# EAGLE design PowerSpy (EAGLE 9.5.2)
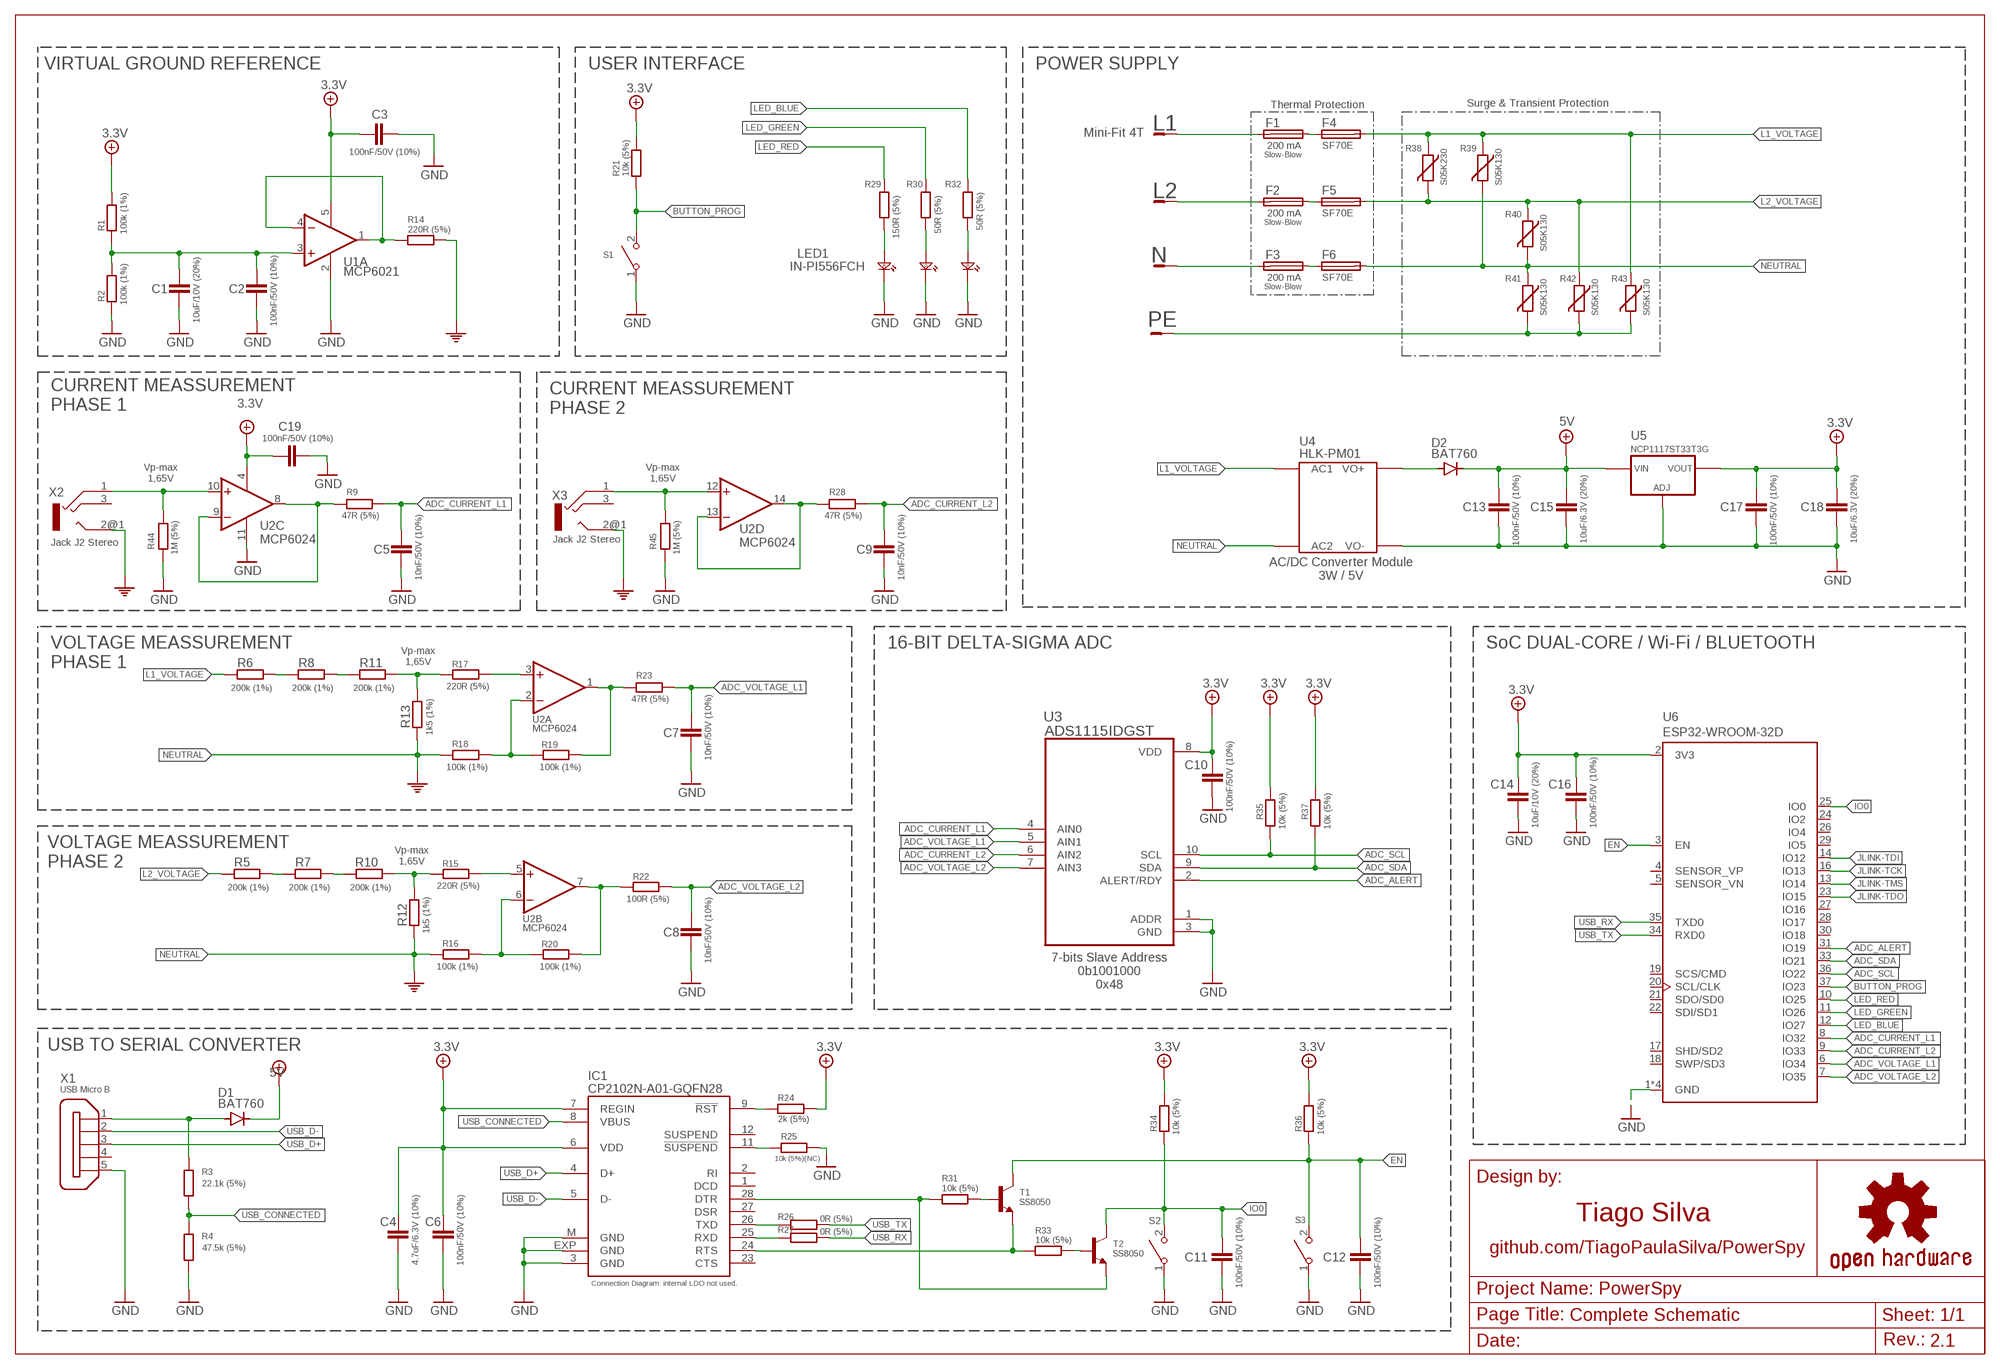
[diagram p0: schematic, sheet 1]

## Parts
C1  10uF/10V (20%)  C-EUC0603K  [C0603K]
C2  100nF/50V (10%)  C-EUC0603K  [C0603K]
C3  100nF/50V (10%)  C-EUC0603K  [C0603K]
C4  4.7uF/6.3V (10%)  C-EUC0603K  [C0603K]
C5  10nF/50V (10%)  C-EUC0603K  [C0603K]
C6  100nF/50V (10%)  C-EUC0603K  [C0603K]
C7  10nF/50V (10%)  C-EUC0603K  [C0603K]
C8  10nF/50V (10%)  C-EUC0603K  [C0603K]
C9  10nF/50V (10%)  C-EUC0603K  [C0603K]
C10  100nF/50V (10%)  C-EUC0603K  [C0603K]
C11  100nF/50V (10%)  C-EUC0603K  [C0603K]
C12  100nF/50V (10%)  C-EUC0603K  [C0603K]
C13  100nF/50V (10%)  C-EUC0603K  [C0603K]
C14  10uF/10V (20%)  C-EUC0603K  [C0603K]
C15  10uF/6.3V (20%)  C-EUC0603K  [C0603K]
C16  100nF/50V (10%)  C-EUC0603K  [C0603K]
C17  100nF/50V (10%)  C-EUC0603K  [C0603K]
C18  10uF/6.3V (20%)  C-EUC0603K  [C0603K]
C19  100nF/50V (10%)  C-EUC0603K  [C0603K]
CN1  Mini-Fit 4T  39-30-04_S  [39-30-?04?]
D1  BAT760  DIODE-SOD323-W  [SOD323-W]
D2  BAT760  DIODE-SOD323-W  [SOD323-W]
F1  200 mA  QPL  [QPL]
F2  200 mA  QPL  [QPL]
F3  200 mA  QPL  [QPL]
F4  SF70E  LITTLEFUSE  [LITTLEFUSE]
F5  SF70E  LITTLEFUSE  [LITTLEFUSE]
F6  SF70E  LITTLEFUSE  [LITTLEFUSE]
IC1  CP2102N-A01-GQFN28  CP2102  [MLP28]
LED1  IN-PI556FCH  [INPI556FCH]
R1  100k (1%)  R-EU_R0603  [R0603]
R2  100k (1%)  R-EU_R0603  [R0603]
R3  22.1k (5%)  R-EU_R0603  [R0603]
R4  47.5k (5%)  R-EU_R0603  [R0603]
R5  200k (1%)  R-EU_R0603  [R0603]
R6  200k (1%)  R-EU_R0603  [R0603]
R7  200k (1%)  R-EU_R0603  [R0603]
R8  200k (1%)  R-EU_R0603  [R0603]
R9  47R (5%)  R-EU_R0603  [R0603]
R10  200k (1%)  R-EU_R0603  [R0603]
R11  200k (1%)  R-EU_R0603  [R0603]
R12  1k5 (1%)  R-EU_R0603  [R0603]
R13  1k5 (1%)  R-EU_R0603  [R0603]
R14  220R (5%)  R-EU_R0603  [R0603]
R15  220R (5%)  R-EU_R0603  [R0603]
R16  100k (1%)  R-EU_R0603  [R0603]
R17  220R (5%)  R-EU_R0603  [R0603]
R18  100k (1%)  R-EU_R0603  [R0603]
R19  100k (1%)  R-EU_R0603  [R0603]
R20  100k (1%)  R-EU_R0603  [R0603]
R21  10k (5%)  R-EU_R0603  [R0603]
R22  100R (5%)  R-EU_R0603  [R0603]
R23  47R (5%)  R-EU_R0603  [R0603]
R24  2k (5%)  R-EU_R0603  [R0603]
R25  10k (5%)(NC)  R-EU_R0603  [R0603]
R26  0R (5%)  R-EU_R0603  [R0603]
R27  0R (5%)  R-EU_R0603  [R0603]
R28  47R (5%)  R-EU_R0603  [R0603]
R29  150R (5%)  R-EU_R0603  [R0603]
R30  50R (5%)  R-EU_R0603  [R0603]
R31  10k (5%)  R-EU_R0603  [R0603]
R32  50R (5%)  R-EU_R0603  [R0603]
R33  10k (5%)  R-EU_R0603  [R0603]
R34  10k (5%)  R-EU_R0603  [R0603]
R35  10k (5%)  R-EU_R0603  [R0603]
R36  10k (5%)  R-EU_R0603  [R0603]
R37  10k (5%)  R-EU_R0603  [R0603]
R38  S05K230  VARISTORS05K11  [S05K11]
R39  S05K130  VARISTORS05K11  [S05K11]
R40  S05K130  VARISTORS05K11  [S05K11]
R41  S05K130  VARISTORS05K11  [S05K11]
R42  S05K130  VARISTORS05K11  [S05K11]
R43  S05K130  VARISTORS05K11  [S05K11]
R44  1M (5%)  R-EU_R0603  [R0603]
R45  1M (5%)  R-EU_R0603  [R0603]
S1  TL3302AF180QG  434121050816  [434121050816]
S2  TL3302AF180QG  434121050816  [434121050816]
S3  TL3302AF180QG  434121050816  [434121050816]
T1  SS8050  BC848  [SOT23]
T2  SS8050  BC848  [SOT23]
U1  MCP6021  [SOT23-5]
U2  MCP6024  [14-SOIC]
U3  ADS1115IDGST  [SOP50P490X110-10N]
U4  HLK-PM01  [HLK-PM01]
U5  NCP1117ST33T3G  REG1117  [SOT223]
U6  ESP32-WROOM-32D  [MODULE_ESP32-WROOM-32D]
X1  USB Micro B  ZX62D-B-5PA8  [ZX62D-B-5PA8]
X2  Jack J2 Stereo  1503_07  [1503_07]
X3  Jack J2 Stereo  1503_07  [1503_07]

## Nets
3.3V: C4.1 C6.1 C10.1 C14.1 C16.1 C17.1 C18.1 IC1.6(VDD) IC1.7(REGIN) R1.1 R21.1 R24.2 R34.1 R35.1 R36.1 R37.1 U3.8(VDD) U5.2(VOUT) U5.4(VOUT) U6.2(3V3)
5V: C13.1 C15.1 D1.C D2.C U5.3(VIN)
+4.1V: C3.1 C19.1 U1.5(V+) U2.4(V+) ; supply symbol labelled 3.3V
ADC_ALERT: U3.2(ALERT/RDY) U6.31(IO19)
ADC_CURRENT_L1: C5.1 R9.1 U3.4(AIN0) U6.8(IO32)
ADC_CURRENT_L2: C9.1 R28.1 U3.6(AIN2) U6.9(IO33)
ADC_SCL: R35.2 U3.10(SCL) U6.36(IO22)
ADC_SDA: R37.2 U3.9(SDA) U6.33(IO21)
ADC_VOLTAGE_L1: C7.1 R23.1 U3.5(AIN1) U6.6(IO34)
ADC_VOLTAGE_L2: C8.1 R22.1 U3.7(AIN3) U6.7(IO35)
BUTTON_PROG: R21.2 S1.2 U6.37(IO23)
DTR: IC1.28(DTR) R31.2 T2.2(E)
EN: C12.1 R36.2 S3.2 T1.3(C) U6.3(EN)
GND: C1.2 C2.2 C3.2 C4.2 C5.2 C6.2 C7.2 C8.2 C9.2 C10.2 C11.2 C12.2 C13.2 C14.2 C15.2 C16.2 C17.2 C18.2 C19.2 IC1.3(GND) IC1.EXP(GND) IC1.M(GND) LED1.4(KB4) LED1.5(KG6) LED1.6(KR5) R2.2 R4.1 R25.1 R44.2 R45.2 S1.1 S2.1 S3.1 U1.2(V-) U2.11(V-) U3.1(ADDR) U3.3(GND) U4.P$3(VO-) U5.1(GND) U6.1(GND) U6.15(GND) U6.38(GND) U6.39(GND) X1.5
IO0: C11.1 R34.2 S2.2 T2.3(C) U6.25(IO0)
JLINK-TCK: U6.16(IO13)
JLINK-TDI: U6.14(IO12)
JLINK-TDO: U6.23(IO15)
JLINK-TMS: U6.13(IO14)
L1_VOLTAGE: F4.2 R6.1 R38.1 R39.1 R43.1 U4.P$1(AC1)
L2_VOLTAGE: F5.2 R5.1 R38.2 R40.1 R42.1
LED_BLUE: R32.1 U6.12(IO27)
LED_GREEN: R30.1 U6.11(IO26)
LED_RED: R29.1 U6.10(IO25)
N$1: IC1.11(!SUSPEND) R25.2
N$2: IC1.9(!RST) R24.1
N$3: LED1.2(AR2) R29.2
N$4: F1.1 F4.1
N$5: R33.1 T2.1(B)
N$6: D2.A U4.P$4(VO+)
N$7: R31.1 T1.1(B)
N$8: IC1.26(TXD) R26.2
N$9: F2.1 F5.1
N$10: IC1.25(RXD) R27.2
N$11: R9.2 U2.8(C:OUT) U2.9(C:-IN)
N$12: R8.2 R11.1
N$13: R14.2 U1.1(A:OUT) U1.4(A:-IN)
N$14: C1.1 C2.1 R1.2 R2.1 U1.3(A:+IN)
N$15: R19.1 R23.2 U2.1(A:OUT)
N$16: R10.2 R12.1 R15.2
N$17: F3.1 F6.1
N$18: CN1.4 R41.2 R42.2 R43.2
N$19: R6.2 R8.1
N$20: R20.1 R22.2 U2.7(B:OUT)
N$21: LED1.1(AG1) R30.2
N$22: R28.2 U2.13(D:-IN) U2.14(D:OUT)
N$23: CN1.1 F1.2
N$24: CN1.2 F2.2
N$25: CN1.3 F3.2
N$26: LED1.3(AB3) R32.2
N$27: R7.2 R10.1
N$29: R5.2 R7.1
N$30: R18.1 R19.2 U2.2(A:-IN)
N$31: R11.2 R13.1 R17.2
N$32: R17.1 U2.3(A:+IN)
N$33: R16.1 R20.2 U2.6(B:-IN)
N$34: R15.1 U2.5(B:+IN)
N$35: R44.1 U2.10(C:+IN) X2.1
N$36: R45.1 U2.12(D:+IN) X3.1
NEUTRAL: F6.2 R12.2 R13.2 R14.1 R16.2 R18.2 R39.2 R40.2 R41.1 U4.P$2(AC2) X3.2@1
PE: X2.2@1
RTS: IC1.24(RTS) R33.2 T1.2(E)
USB_CONNECTED: IC1.8(VBUS) R3.1 R4.2
USB_D+: IC1.4(D+) X1.3
USB_D-: IC1.5(D-) X1.2
USB_RX: R27.1 U6.35(TXD0)
USB_TX: R26.1 U6.34(RXD0)
VUSB: D1.A R3.2 X1.1
Unconnected: IC1.1(DCD) IC1.2(RI) IC1.12(SUSPEND) IC1.23(CTS) IC1.27(DSR) U6.4(SENSOR_VP) U6.5(SENSOR_VN) U6.17(SHD/SD2) U6.18(SWP/SD3) U6.19(SCS/CMD) U6.20(SCL/CLK) U6.21(SDO/SD0) U6.22(SDI/SD1) U6.24(IO2) U6.26(IO4) U6.27(IO16) U6.28(IO17) U6.29(IO5) U6.30(IO18) X1.4 X1.S1 X1.S2 X1.S3 X1.S4 X2.2@2 X2.3 X3.2@2 X3.3

## Notes on the sheet
- USER INTERFACE | POWER SUPPLY
- VIRTUAL GROUND REFERENCE
- Thermal Protection | Surge & Transient Protection
- L1
- Slow-Blow
- L2
- Slow-Blow
- N
- Slow-Blow
- PE
- CURRENT MEASSUREMENT
  PHASE 1
- CURRENT MEASSUREMENT
  PHASE 2
- Vp-max
  1,65V
- Vp-max
  1,65V
- AC/DC Converter Module
  3W / 5V
- 16-BIT DELTA-SIGMA ADC | SoC DUAL-CORE / Wi-Fi / BLUETOOTH
- Vp-max
  1,65V
- VOLTAGE MEASSUREMENT
  PHASE 1
- Vp-max
  1,65V
- VOLTAGE MEASSUREMENT
  PHASE 2
- 7-bits Slave Address
  0b1001000
  0x48
- USB TO SERIAL CONVERTER
- Tiago Silva
- github.com/TiagoPaulaSilva/PowerSpy
- Connection Diagram: internal LDO not used.
- Complete Schematic
- 2.1

## Library data of the parts
C1-C19 = rcl:C-EU: CAPACITOR, European symbol; SPICEPREFIX: C
CN1 = con-molex-mini-fit:39-30-?04?_S: HEADER
D1 D2 = diode:DIODE-: DIODE
F1-F3 = fuse:QPL: Fuseholder for Micro(TM) Fuse or Pico(R) II Fuses 281 005, 281 008 Source:www.littlefuse.com .. 281005A.PDF; OC_FARNELL: 1608231; OC_NEWARK: unknown
F4-F6 = fuse:LITTLEFUSE: LITTLEFUSE Picofuse/slow Littlefuse; OC_FARNELL: unknown; OC_NEWARK: unknown
IC1 = silabs:CP210*: Single-Chip USB to UART Bridge Source: www.silabs.com .. CP2101.pdf / cp2102.pdf; MF: FARNELL; MPN: CP2102-GM; OC_FARNELL: 9282130; OC_NEWARK: 30K5635
LED1 = LED RGB SMD:IN-PI556FCH: Standard LEDs - SMD RGB Digital LED Source: Datasheet <https://componentsearchengine.com/Datasheets/1/IN-PI556FCH.pdf>; DESCRIPTION: Standard LEDs - SMD RGB Digital LED; HEIGHT: 1.5mm; MANUFACTURER_NAME: Inolux; MANUFACTURER_PART_NUMBER: LED RGB 5050; MOUSER_PART_NUMBER: 743-IN-PI556FCH; MOUSER_PRICE-STOCK: https://www.mouser.com/Search/Refine.aspx?Keyword=743-IN-PI556FCH
R1-R37 R44 R45 = rcl:R-EU_: RESISTOR, European symbol; SPICEPREFIX: R
R38-R43 = varistor:VARISTOR: VARISTOR
S1-S3 = Push Button:434121050816: 6.0x3.5 mm SMD WS-TASV <http://katalog.we-online.de/media/images/v2/Family_WS-TASV_6.0x3.jpg> Details see: http://katalog.we-online.de/em/datasheet/4341x1xxx8x6.pdf 2015 (C) Wurth Elektronik; AVAILABILITY: Unavailable; DESCRIPTION: Pushbutton 12 Vdc 0.05 A 1 x Off/_On_ Wuerth Elektronik 434121050816 momentary 1 pc_s_; MF: Wurth Electronics; MP: 434121050816; PACKAGE: None; PRICE: None
T1 T2 = transistor:BC848: NPN TRANSISTOR
U1 = MCP6024:MCP6021
U2 = MCP6024:MCP6024; AVAILABILITY: Unavailable; DESCRIPTION: General Purpose Amplifier 4 Circuit Rail-to-Rail 14-SOIC; MF: Microchip; MP: MCP6024-I/SL; PACKAGE: SOIC-14 Microchip; PRICE: None
U3 = ADS1115IDGST:ADS1115IDGST: Analog-to-Digital Converter with Internal Reference; AVAILABILITY: Unavailable; DESCRIPTION: 16-Bit ADC with Integrated MUX, PGA, Comparator, Oscillator, and Reference 10-VSSOP -40 to 125; MF: Texas Instruments; MP: ADS1115IDGST; PACKAGE: MSOP-10 Texas Instruments; PRICE: None
U4 = HLK-PM01:HLK-PM01: HI-LINK Ultra-compact power module HLK-PM01 Meet UL, CE requirements Ultra-thin, ultra-small All voltage input (AC: 90 ~ 264V) Low ripple and low noise Output overload and short circuit protection High efficiency, high power density The product is designed to meet the requirements of EMC and Safety Test Low power consumption, environmental protection, no-load loss <0.1W 100% load aging and testing; AVAILABILITY: Unavailable; MF: Hi-link; MP: hlk-pm01; PACKAGE: Package Analog Devices; PRICE: None
U5 = REG1117:REG1117: 800mA and 1A Low Dropout (LDO) Positive Regulator 1.8V, 2.5V, 2.85V, 3.3V, 5V, and Adj; AVAILABILITY: Unavailable; DESCRIPTION: LDO Regulator Pos 1.25V to 13.5V 0.8A 4-Pin_3+Tab_ SOT-223 Tube; MF: Texas Instruments; MP: REG1117; PACKAGE: SOT-223-4 Texas Instruments; PRICE: None
U6 = ESP32-WROOM-32D:ESP32-WROOM-32D: IC: SoC; GPIO, I2C, I2S, IR, SD, SDIO, SPI, UART; 2.7÷3.6VDC; 20dBm; AVAILABILITY: Unavailable; DESCRIPTION: IC: SoC; GPIO, I2C, I2S, IR, SD, SDIO, SPI, UART; 2.7÷3.6VDC; 20dBm; MF: Espressif Systems; MP: ESP32-WROOM-32D; PACKAGE: Module Espressif Systems; PRICE: None
X1 = Micro USB Connector:ZX62D-B-5PA8: Micro USB Type B Connector - Standard, Shell Through Hole Source: http://www.hirose.co.jp/cataloge_hp/ed_ZX_20140804.pdf; MF: Hirose; MPN: ZX62D-B-5PA8; OC_FARNELL: 2300438; OC_NEWARK: 69W0712
X2 X3 = con-lumberg:1503_?: Jack connectors according to JISC 6560, 3.5 mm Klinkensteckverbinder nach JISC 6560, 3,5 mm Source: http://www.lumberg.com/Produkte/PDFs/1503_08.pdf; OC_FARNELL: unknown; OC_NEWARK: unknown

## Board
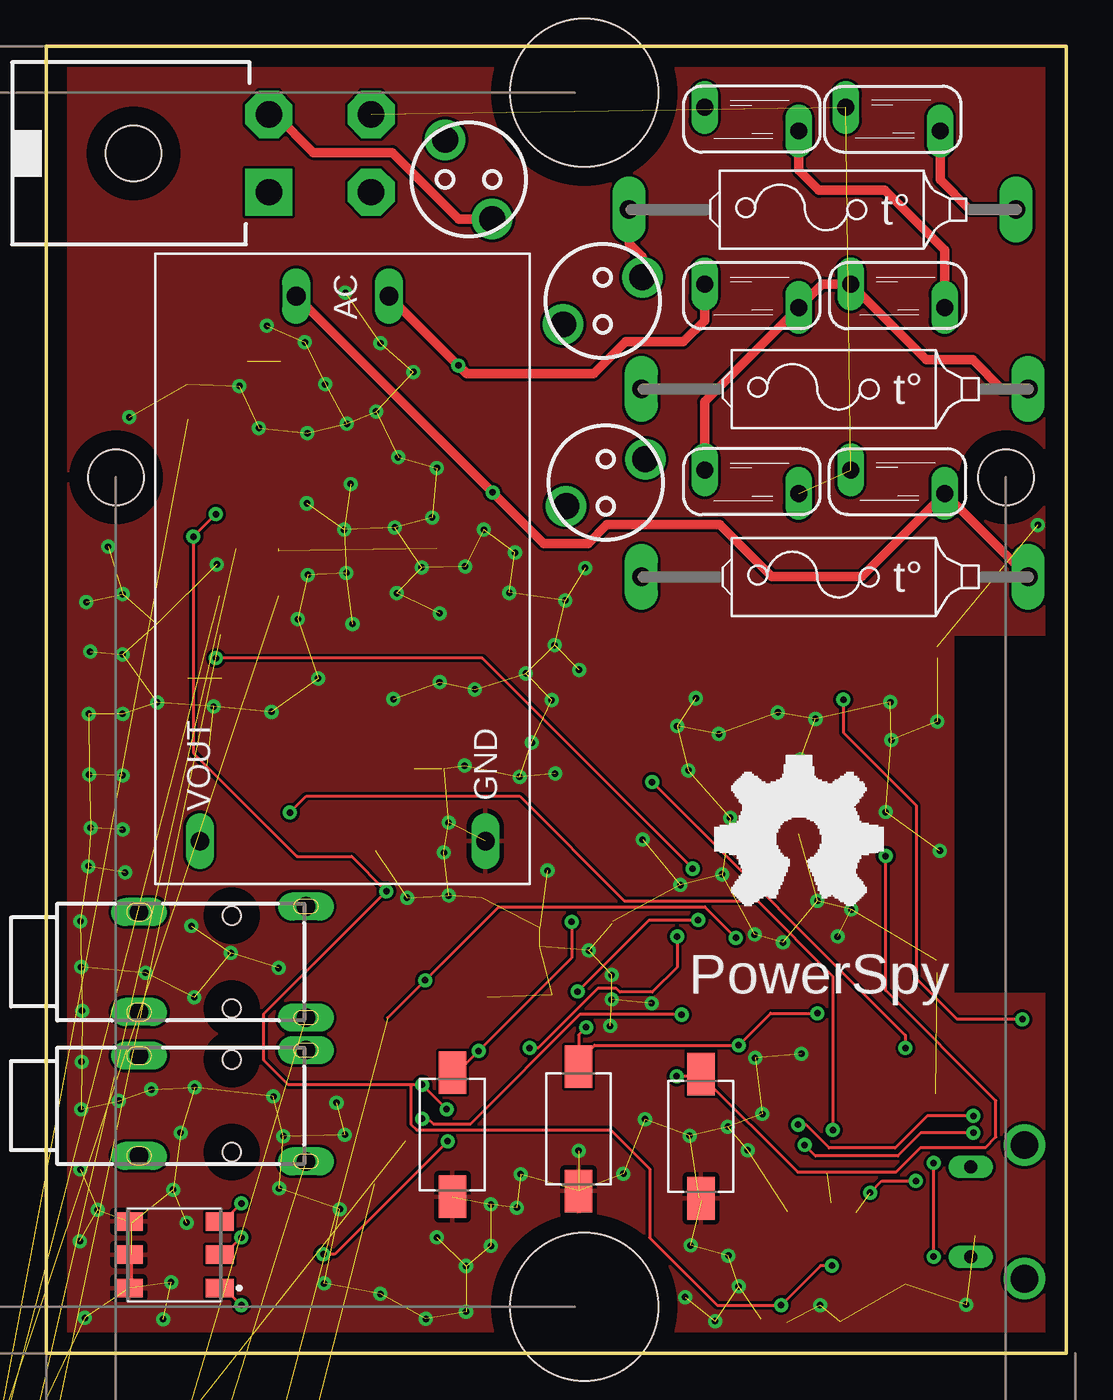
[diagram p1: board, top side]
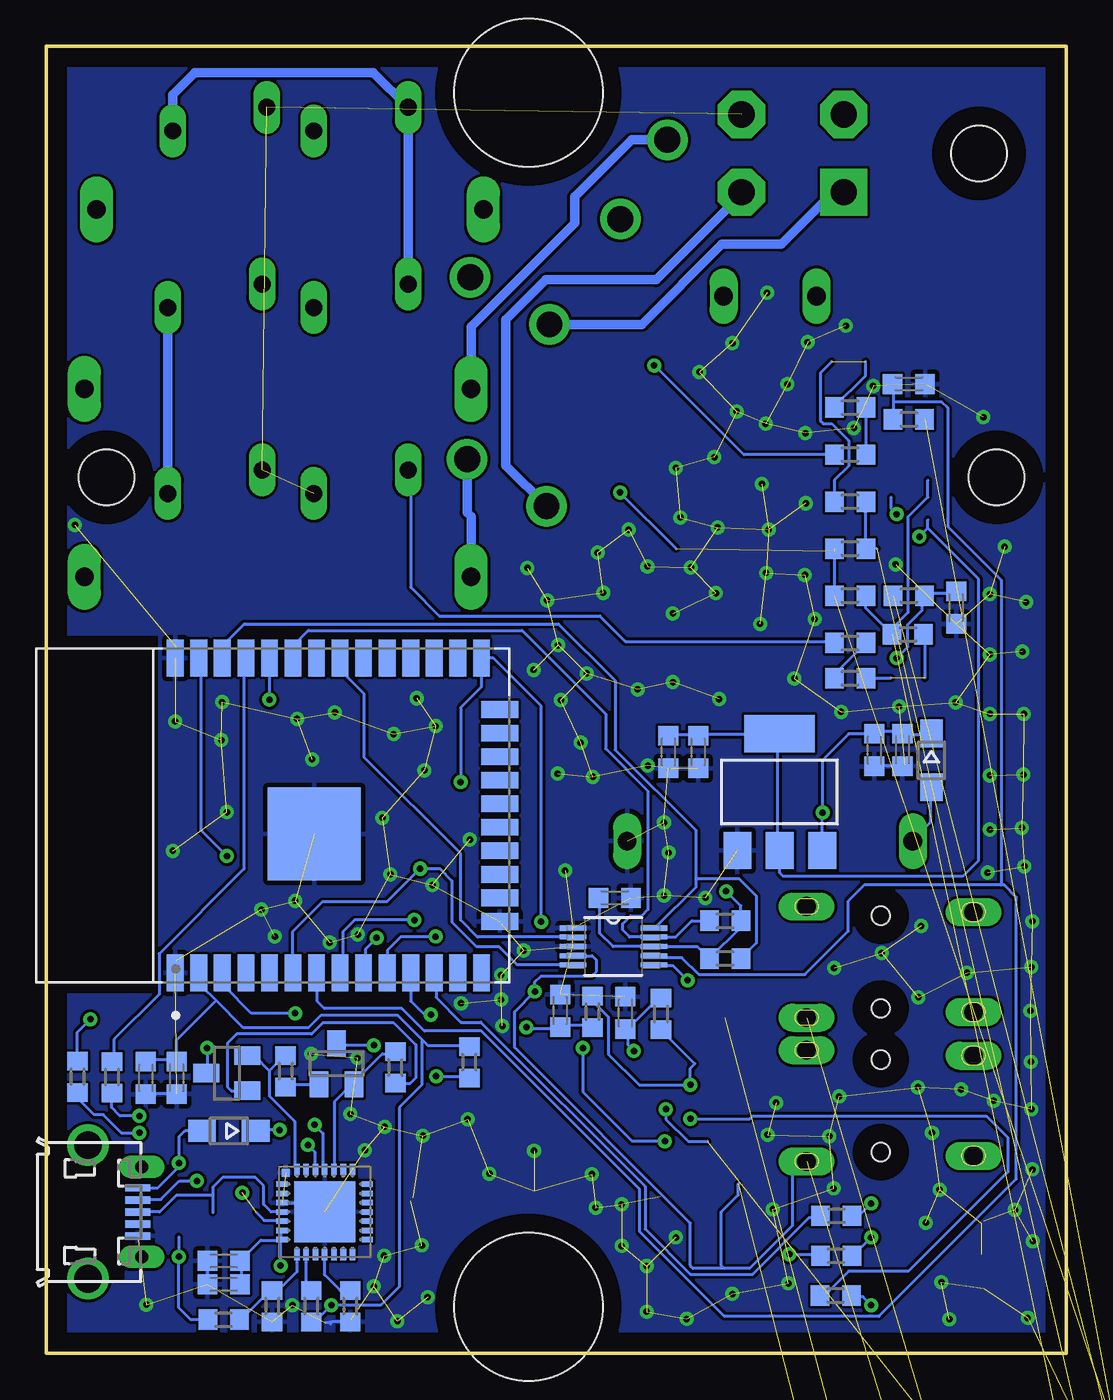
[diagram p2: board, bottom side, seen from below]

Size 55 x 70.5 mm. Coordinates in mm from the lower left corner, seen from the top.
Outline: 0,0 55,0 55,70.5 0,70.5 0,0
Copper layers (1*16): Top 0.035mm / dielectric 1.5mm / Bottom 0.035mm
Design rules "default": minimum track width 6mil, minimum drill 0.35mm, track to track 6mil, track to pad 6mil, pad to pad 6mil, via to via 6mil, smd to smd 6mil, copper to edge 40mil, drill to drill 6mil, minimum pad ring 10mil, minimum via ring 8mil, stop-mask expansion 4mil, vias tented up to drill 0mil, thermal gap 10mil
Holes 8 mm at 29,68 29,2.5
Holes 3 mm at 3.75,47.25 51.75,47.25
tRestrict: area 49,19.5 to 55.5,38.7
bRestrict: area 49,19.4 to 55.4,38.7

### Footprints (pad centres in the part's own frame; a part is rotated, then mirrored left to right if it is on the bottom)
C0603K = smd 1.05 x 1.08: 1 -0.875,0; 2 0.875,0
39-30-?04? = drill 1.422 pad 2.54 square: 1 2.095,0 | drill 1.422 pad 2.54 octagon: 2 -2.095,0; 3 2.095,5.512; 4 -2.095,5.512 | hole 3: 0,-7.3
SOD323-W = smd 1.5 x 1.2: A 1.45,0; C -1.45,0
QPL = drill 1.4 pad 2.184: 1 -1.27,2.139; 2 1.27,-2.139
LITTLEFUSE = drill 1 pad 1.778 long: 1 -9.88,0.2; 2 10.98,0.2
MLP28 = smd 0.6 x 0.3: 1 -2.3,1.5; 2 -2.3,1; 3 -2.3,0.5; 4 -2.3,0; 5 -2.3,-0.5; 6 -2.3,-1; 7 -2.3,-1.5; 15 2.3,-1.5; 16 2.3,-1; 17 2.3,-0.5; 18 2.3,0; 19 2.3,0.5; 20 2.3,1; 21 2.3,1.5 | smd 0.3 x 0.6: 8 -1.5,-2.3; 9 -1,-2.3; 10 -0.5,-2.3; 11 0,-2.3; 12 0.5,-2.3; 13 1,-2.3; 14 1.5,-2.3; 22 1.5,2.3; 23 1,2.3; 24 0.5,2.3; 25 0,2.3; 26 -0.5,2.3; 27 -1,2.3; 28 -1.5,2.3 | smd 3.3 x 3.3: EXP 0,0 | smd 0.435 x 0.435: M -2.103,2.103
INPI556FCH = smd 1 x 1.5: 1 -1.8,-2.45; 2 0,-2.45; 3 1.8,-2.45; 4 1.8,2.45; 5 0,2.45; 6 -1.8,2.45
R0603 = smd 1 x 1.1: 1 -0.85,0; 2 0.85,0
S05K11 = drill 0.914 long: 1 -0.635,-2.54; 2 0.635,2.54
434121050816 = smd 2.3 x 1.5: 1 -3.35,0; 2 3.35,0
SOT23 = smd 1 x 1.4: 1 -0.95,-1.1; 2 0.95,-1.1; 3 0,1.1
SOT23-5 = smd 1.321 x 0.559: 1 -1.194,0.95; 2 -1.194,0; 3 -1.194,-0.95; 4 1.194,-0.95; 5 1.194,0.95
14-SOIC = smd 1.9 x 0.6: 1 -2.455,3.81; 2 -2.455,2.54; 3 -2.455,1.27; 4 -2.455,0; 5 -2.455,-1.27; 6 -2.455,-2.54; 7 -2.455,-3.81; 8 2.455,-3.81; 9 2.455,-2.54; 10 2.455,-1.27; 11 2.455,0; 12 2.455,1.27; 13 2.455,2.54; 14 2.455,3.81
SOP50P490X110-10N = smd 1.422 x 0.279: 1 -2.184,0.991; 2 -2.184,0.508; 3 -2.184,0; 4 -2.184,-0.508; 5 -2.184,-0.991; 6 2.184,-0.991; 7 2.184,-0.508; 8 2.184,0; 9 2.184,0.508; 10 2.184,0.991
HLK-PM01 = drill 1 long: P$1 -14.7,2.5; P$2 -14.7,-2.5; P$3 14.7,7.7; P$4 14.7,-7.7
SOT223 = smd 1.499 x 2.007: 1 -2.261,-3.15; 2 0.025,-3.15; 3 2.311,-3.15 | smd 3.81 x 2.007: 4 0,3.15
MODULE_ESP32-WROOM-32D = smd 2 x 0.9: 1 -8.5,5.26; 2 -8.5,3.99; 3 -8.5,2.72; 4 -8.5,1.45; 5 -8.5,0.18; 6 -8.5,-1.09; 7 -8.5,-2.36; 8 -8.5,-3.63; 9 -8.5,-4.9; 10 -8.5,-6.17; 11 -8.5,-7.44; 12 -8.5,-8.71; 13 -8.5,-9.98; 14 -8.5,-11.25; 25 8.5,-11.25; 26 8.5,-9.98; 27 8.5,-8.71; 28 8.5,-7.44; 29 8.5,-6.17; 30 8.5,-4.9; 31 8.5,-3.63; 32 8.5,-2.36; 33 8.5,-1.09; 34 8.5,0.18; 35 8.5,1.45; 36 8.5,2.72; 37 8.5,3.99; 38 8.5,5.26 | smd 0.9 x 2: 15 -5.715,-12.25; 16 -4.445,-12.25; 17 -3.175,-12.25; 18 -1.905,-12.25; 19 -0.635,-12.25; 20 0.635,-12.25; 21 1.905,-12.25; 22 3.175,-12.25; 23 4.445,-12.25; 24 5.715,-12.25 | smd 5 x 5: 39 -1,-2.24
ZX62D-B-5PA8 = smd 1.35 x 0.4: 1 4.825,1.3; 2 4.825,0.65; 3 4.825,0; 4 4.825,-0.65; 5 4.825,-1.3 | drill 1.5: S1 2.15,-3.6; S2 2.15,3.6 | drill 0.7 long: S3 5.05,2.425; S4 5.05,-2.425
1503_07 = drill 1 pad 1.2 long: 1 -3,-11; 2@1 -2.7,-2; 2@2 2.7,-2; 3 3,-11 | hole 1: -2.5,-7; 2.5,-7

### Placement (x,y rotation side)
C1  -22.25,-51.71 0 top  (outside the outline)
C2  -22.25,-56.08 0 top  (outside the outline)
C3  -34.54,-178.1 0 top  (outside the outline)
C4  45.44,4.98 180 bottom
C5  -30.58,-149.86 0 top  (outside the outline)
C6  45.44,3.71 180 bottom
C7  5.94,40.22 270 bottom
C8  8.48,52.28 0 bottom
C9  -30.58,-173.74 0 top  (outside the outline)
C10  24.35,24.57 0 bottom
C11  23.77,18.35 90 bottom
C12  27.29,18.48 90 bottom
C13  8.83,32.55 270 bottom
C14  47.97,14.86 270 bottom
C15  10.35,32.53 270 bottom
C16  49.63,14.85 270 bottom
C17  19.85,32.43 270 bottom
C18  21.45,32.43 270 bottom
C19  -34.54,-182.47 0 top  (outside the outline)
CN1  12,64.73 270 top
D1  45.16,11.99 180 bottom
D2  7.27,31.98 270 bottom
F1  30,56.77 270 top
F2  22.77,63.32 0 top
F3  30.17,46.96 270 top
F4  41.31,61.49 0 top
F5  41.97,51.81 0 top
F6  41.97,41.68 0 top
IC1  39.99,7.62 0 bottom
LED1  6.9,5.31 90 top
R1  -22.25,-42.27 0 top  (outside the outline)
R2  -22.25,-47.14 0 top  (outside the outline)
R3  45.44,1.8 180 bottom
R4  42.82,2.54 90 bottom
R5  11.66,38.31 0 bottom
R6  11.66,48.47 0 bottom
R7  11.66,36.41 0 bottom
R8  11.66,51.01 180 bottom
R9  -20.93,-145.29 0 top  (outside the outline)
R10  8.54,38.77 180 bottom
R11  11.66,45.93 0 bottom
R12  11.66,40.85 180 bottom
R13  11.66,43.39 180 bottom
R14  -22.25,-65.13 0 top  (outside the outline)
R15  -22.25,-108 0 top  (outside the outline)
R16  -22.25,-117.75 0 top  (outside the outline)
R17  -22.25,-93.88 0 top  (outside the outline)
R18  -22.25,-89 0 top  (outside the outline)
R19  -22.25,-84.12 0 top  (outside the outline)
R20  -22.25,-112.88 0 top  (outside the outline)
R21  32.19,15.69 270 bottom
R22  8.48,50.38 0 bottom
R23  8.48,40.85 180 bottom
R24  40.72,2.54 270 bottom
R25  38.61,2.54 90 bottom
R26  53.33,14.91 270 bottom
R27  51.47,14.88 270 bottom
R28  -30.58,-169.16 0 top  (outside the outline)
R29  12.41,5.25 0 bottom
R30  12.44,3.11 0 bottom
R31  42.09,15.21 90 bottom
R32  12.4,7.41 0 bottom
R33  36.18,15.41 90 bottom
R34  21.85,18.3 90 bottom
R35  18.39,21.29 0 bottom
R36  25.54,18.42 270 bottom
R37  18.4,23.32 180 bottom
R38  38.03,57.05 270 top
R39  38.03,66.57 270 top
R40  45.91,57.05 270 top
R41  45.91,47.01 90 top
R42  38.03,47.01 270 top
R43  45.66,66.57 90 top
R44  -34.54,-187.15 0 top  (outside the outline)
R45  -34.54,-192.02 0 top  (outside the outline)
S1  35.3,11.7 90 top
S2  21.9,11.79 90 top
S3  28.7,12.1 90 top
T1  39.35,15.61 0 bottom
T2  45.27,15.11 90 bottom
U1  -34.14,-174.14 0 top  (outside the outline)
U2  -27.53,-113.79 0 top  (outside the outline)
U3  24.42,21.94 0 bottom
U4  15.98,42.32 270 top
U5  15.47,30.27 0 bottom
U6  42.79,29 90 bottom
X1  54.9,7.62 0 bottom
X2  3,13.35 90 top
X3  3,21.1 90 top

### Tracks (layer width: path | path; a pad name or v marks a point on that pad's centre or on a via)
3.3V  (via drill 0.35)  (1 unrouted)
  Top 0.152: v21.59,13.16 v20.27,14.48 19.66,14.48 | 19.66,14.48 13.06,14.48 11.73,15.8 11.73,18.31 v18.34,24.92 16.46,26.8 13.51,26.8 7.92,32.38 v7.92,44.04 v9.14,45.26 | 19.66,14.48 19.66,12.34 19.96,12.04 30.43,12.04 32.54,9.93 32.54,6.22 36.17,2.59 v39.62,2.59 41.76,4.72 v42.37,4.72
  Bottom 0.152: IC1.6 42.37,6.55 42.37,6.25 IC1.7 42.37,6.1 | 42.37,6.1 43.43,6.1 44.5,5.03 C4.1 44.5,4.88 44.5,3.81 C6.1 | C16.1 49.53,15.85 48.01,15.85 C14.1 47.97,16.9 45.85,19.02 | 34.75,16.92 36.04,18.21 40.21,18.21 40.87,17.55 44.37,17.55 45.85,19.02 | 34.75,16.92 34.44,16.61 32.31,16.61 R21.1 | 45.85,19.02 46.63,19.81 46.63,20.42 U6.2 | 34.75,16.92 34.75,14.48 35.97,13.26 35.97,3.58 36.96,2.59 v39.62,2.59 40.52,1.69 R24.2 | v42.37,4.72 42.37,6.1 | C10.1 25.15,24.54 25.15,22.66 24.43,21.94 U3.8 19.89,21.94 R35.1 17.55,22.98 R37.1 17.55,24.13 v18.34,24.92 | 21.49,17.07 21.79,17.37 R34.1 21.49,17.07 | 19.36,11.43 20.4,11.43 21.59,12.62 v21.59,13.16 | R36.1 25.45,19.2 25.45,18.9 24.69,18.14 24.69,16.13 23.04,14.48 v20.27,14.48 20.27,15.37 20.03,15.61 21.49,17.07 | C18.1 21.34,33.38 19.96,33.38 C17.1 19.81,33.38 15.54,33.38 | 7.47,44.5 7.47,44.96 | 7.47,44.5 4.72,41.76 4.72,26.59 5.59,25.73 15.27,25.73 15.45,25.91 U5.2 15.54,27.13 15.54,33.38 | 9.45,46.18 9.45,45.57 v9.14,45.26 | 7.47,44.5 v7.92,44.04 | 15.54,33.38 U5.4
5V  (via drill 0.35)
  Top 0.152: v42.42,12.04 42.42,20.32 38.35,24.38 31.17,24.38 31.17,24.41 25.53,30.05 14.02,30.05 v13.13,29.16
  Bottom 0.152: D2.C 7.32,33.38 8.69,33.38 C13.1 8.84,33.53 10.21,33.53 C15.1 11.73,33.41 13.16,31.98 13.16,29.13 | v42.42,12.04 43.59,12.04 D1.C | U5.3 13.16,29.13 | 13.16,29.13 v13.13,29.16
+4.1V  (3 unrouted)
ADC_ALERT
  Bottom 0.152: U6.31 39.01,37.49 39.01,36.73 37.86,35.57 37.86,32.14 32.66,26.95 32.66,23.36 31.75,22.45 U3.2
ADC_CURRENT_L1  (via drill 0.35)  (2 unrouted)
  Top 0.152: v35.15,23.37 32.51,23.37 v28.65,19.51
  Bottom 0.152: 17.68,9.14 17.68,8.53 18.59,7.62 18.59,4.72 18.44,4.57 | 18.44,4.57 17.07,4.57 14.78,6.86 14.78,10.21 | 18.44,4.57 20.12,4.57 20.27,4.72 20.27,7.01 29.74,16.48 29.74,18.41 v28.65,19.51 28.65,20.02 28.32,20.34 25.58,20.34 25.32,20.6 25.32,21.18 25.57,21.43 U3.4 | v35.15,23.37 38.38,23.37 39.01,22.73 39.01,20.57 U6.8
ADC_CURRENT_L2  (via drill 0.35)  (2 unrouted)
  Top 0.152: v37.19,22.4 35.51,24.08 24.38,24.08 v20.42,20.12 18.41,18.1
  Bottom 0.152: v20.42,20.12 21.18,20.88 22.1,20.88 U3.6 | v37.19,22.4 37.8,21.79 37.8,20.57 U6.9
ADC_SCL
  Bottom 0.152: 19.96,25.6 17.65,25.6 16.71,24.66 16.71,22.12 R35.2 | U3.10 22.1,23.01 19.96,25.15 19.96,25.6 | 19.96,25.6 19.96,28.19 24.32,32.55 24.32,36.28 27.38,39.34 44.32,39.34 45.41,38.25 45.41,37.64 U6.36
ADC_SDA
  Bottom 0.152: U6.33 41.6,37.64 41.6,38.25 40.87,38.99 29.34,38.99 24.84,34.49 24.84,32.61 22.55,30.33 22.55,23.93 22.89,23.6 23.5,23.6 23.93,23.16 23.93,22.84 23.54,22.45 U3.9 21.06,22.45 20.19,23.32 R37.2
ADC_VOLTAGE_L1  (via drill 0.35)
  Top 0.152: v9.14,37.49 23.5,37.49 v34.85,26.14
  Bottom 0.152: C7.1 5.94,41 7.62,41 R23.1 7.77,40.84 7.77,40.08 8.53,39.32 8.53,38.1 v9.14,37.49 | U3.5 29.61,20.95 30.58,21.92 31.8,21.92 33.13,23.25 33.13,25.49 33.78,26.14 v34.85,26.14 36.64,24.35 40.12,24.35 41.7,22.77 U6.6
ADC_VOLTAGE_L2
  Bottom 0.152: 9.3,51.33 9.3,50.44 R22.1 | 9.3,51.33 9.3,52.27 C8.1 | 3.5,25.25 3.35,25.25 2.69,24.59 2.69,9.4 10.11,1.98 18.44,1.98 23.01,6.55 23.01,8.84 31.55,17.37 34.62,17.37 35.84,18.59 40.01,18.59 40.39,18.97 40.39,20.42 U6.7 | 3.5,25.25 10.9,25.25 11.75,24.4 11.75,22.77 14.1,20.42 19.81,20.42 20.73,21.34 22.1,21.34 U3.7 | 3.5,25.25 3.5,41.71 6.4,44.6 6.4,51 6.73,51.33 9.3,51.33
BUTTON_PROG  (via drill 0.35)
  Top 0.152: v33.98,14.94 35.2,14.94 S1.2 35.36,14.94 40.51,9.78 45.82,9.78 47.14,11.1 50.65,11.1 51.21,11.66 51.21,13.61 45.26,19.56 v45.26,26.82
  Bottom 0.152: v33.98,14.94 32.31,14.94 R21.2 | v45.26,26.82 46.63,28.19 46.63,37.49 U6.37
DTR
  Bottom 0.152: 42.98,15.24 42.98,13.87 41.6,12.5 41.6,10.06 IC1.28 | 42.98,15.24 42.22,16 R31.2 | 42.98,15.24 43.74,16 44.04,16 T2.2
EN  (via drill 0.35)
  Top 0.152: 28.7,15.75 29.57,16.61 v37.34,16.61 39.06,18.34 v41.58,18.34 | S3.2 28.7,15.75 | v29.11,17.58 28.7,17.17 28.7,15.75
  Bottom 0.152: R36.2 25.6,17.68 27.28,17.68 C12.1 27.43,17.53 29.06,17.53 v29.11,17.58 | v37.34,16.61 39.32,16.61 T1.3 | v41.58,18.34 43.94,18.34 45.41,19.81 45.41,20.42 U6.3
GND  (via drill 0.35, 0.35 pad 0.6)  (185 unrouted)
  Top 0.152: LED1.6 4.57,3.66 4.57,5.18 LED1.5 4.57,5.33 | 4.57,7.01 LED1.4 | 35.36,8.23 S1.1 35.2,8.38 | 28.8,8.48 S3.1 28.65,8.64
  Bottom 0.152: C15.2 10.21,31.7 8.84,31.7 C13.2 8.69,31.7 | 7.62,52.43 C8.2 | 21.34,31.55 C18.2 | 48.01,38.1 48.01,37.64 U6.38 | C6.2 46.33,3.81 46.33,4.88 C4.2 46.18,5.03 | C14.2 48.01,14.02 49.53,14.02 C16.2 | IC1.EXP 40.08,7.62 40.58,8.12 IC1.3 | 48.01,21.18 48.01,20.57 U6.1 | 23.77,19.36 C11.2 | 30.48,23.16 U6.15 | 38.56,1.83 R25.1 39.61,1.69 39.7,1.6 39.67,1.57 39.64,1.61 39.69,1.66 39.71,1.66 39.73,1.65 39.94,1.65
  other vias: 22.56,31.7 6.83,8.81 41.73,2.59 37.34,3.61 36.78,5.26 37.82,10.95 36.75,12.22 49.61,2.62 43.41,23.93 36.88,28.88 40.67,32.03 39.45,34.57 41.48,34.21 45.52,35.13 45.57,33.07 45.26,29.18 34.62,31.45 36.27,33.4 34.01,33.83 35.03,35.33 32.28,12.62 31.11,9.68 25.37,7.85 28.7,10.92 34.75,5.82 34.7,11.73 34.44,3.02 36.07,1.73 22.63,2.24 21.06,6.25 20.47,1.85 22.63,4.7 23.98,8.03 23.98,5.79 25.58,9.65 14.99,3.76 18.01,3.2 15.82,7.77 12.55,8.89 12.78,11.71 16.1,11.79 6.73,3.84 2.08,1.91 6.3,1.83 1.8,6.05 7.24,11.89 2.77,7.72 7.57,7.04 3.91,13.61 5.66,14.22 8,14.35 12.24,13.84 15.65,13.51 7.98,19.2 5.36,20.52 7.82,23.04 12.52,20.78 9.96,21.59 1.83,23.29 1.88,20.83 1.93,18.47 1.91,15.72 1.88,13.16 1.83,9.91 18.72,35.28 21.44,27 4.11,34.49 4.11,31.17 4.24,25.93 4.11,28.24 2.39,28.35 2.26,26.26 2.31,31.22 2.29,34.49 4.11,37.69 2.36,37.85 2.16,40.51 4.11,40.94 3.33,43.51 4.47,50.5 14.05,45.85 14.07,49.63 16.41,46.89 16.21,50.14 18.97,48.34 17.78,50.8 19.79,52.93 18.01,54.48 16.13,57.2 11.89,55.42 13.94,54.53 15.04,52.27 11.46,49.91 10.41,52.17 18.8,44.55 9.19,42.55 14.1,41.99 13.56,39.6 16.51,39.34 16.18,42.09 18.9,41 20.24,42.39 20.8,45.09 16.05,44.42 23.6,44.42 21.06,47.75 22.58,42.44 14.66,36.4 12.14,34.59 9.02,34.87 5.97,35.1 21.21,36.2 21.21,39.9 23.11,35.81 25.86,36.68 27.41,38.2 28.73,36.86 27.25,35.23 27.99,40.61 24.97,41.02 25.27,43.18 29.06,42.37 26.19,32.94 27.43,31.27 25.53,31.09 21.69,28.63 21.69,24.69 19.46,24.56 27.03,26.04 32.64,18.87 30.48,19.08 30.4,17.65 38.23,15.93 40.72,16.15 38.2,22.58 39.73,22.15 41.58,24.41 48.06,34.09 48.18,27.1 38.61,12.9 42.67,22.48 36.45,25.83 34.19,25.25 32.16,27.71 53.47,44.68 29.26,21.72 30.48,20.4
  pour Top: 0,0 55.02,0 55.02,70.51 0,70.51
  pour Bottom: 0,0 0,70.51 54.99,70.51 54.99,0
IO0  (via drill 0.35)
  Top 0.152: S2.2 21.91,15.16 22.17,15.16 v23.32,16.31 28.32,21.31 v28.32,23.27 | v46.33,16.46 46.33,17.14 v32.66,30.81
  Bottom 0.152: R34.2 21.95,19.2 23.62,17.53 C11.1 23.62,17.37 23.62,16.61 v23.32,16.31 | v46.33,16.46 46.33,15.24 T2.3 | v28.32,23.27 28.32,34.92 30.89,37.49 U6.25 31.54,35.95 32.66,34.82 v32.66,30.81
L1_VOLTAGE  (via drill 0.35 pad 0.6)
  Top 0.508: F4.2 49.8,61.69 48.2,63.29 R43.1 | U4.P$1 v22.22,53.28 22.67,52.83 29.52,52.83 31.24,54.56 34.34,54.56 35.49,55.71 R38.1
  Bottom 0.152: R6.1 17.38,48.47 22.19,53.28 v22.22,53.28
  Bottom 0.508: R43.1 48.2,67.88 46.99,69.09 37.38,69.09 R39.1 R38.1
L2_VOLTAGE
  Top 0.508: R42.1 35.49,51.33 R38.2 41.84,57.68 R40.1 47.45,53.59 49.95,53.59 51.53,52.01 F5.2
  Bottom 0.152: R5.1 12.65,38.41 23.77,38.41 25.15,39.78 33.81,39.78 35.36,41.33 35.36,47.55 R42.1
LED_BLUE
  Bottom 0.152: R32.1 13.26,7.32 13.87,7.32 16.92,4.27 20.27,4.27 22.71,6.71 22.71,8.99 31.57,17.86 32.64,17.86 33.98,19.2 33.98,20.42 U6.12
LED_GREEN  (via drill 0.35)
  Top 0.152: v20.27,12.65 20.57,12.65 20.88,12.34 22.86,12.34 28.78,18.26 v34.27,18.26
  Bottom 0.152: v20.27,12.65 17.07,12.65 16.92,12.8 4.32,12.8 3.15,11.63 3.15,9.78 8.51,4.42 11.73,4.42 12.95,3.2 13.26,3.2 R30.1 | U6.11 35.35,18.99 34.62,18.26 v34.27,18.26
LED_RED  (via drill 0.35)
  Top 0.152: v14.94,5.33 15.54,5.33 v21.64,11.43 | v26.06,16.46 26.52,16.46 29.74,19.68 30.73,19.68 30.93,19.48 32.69,19.48 34.01,20.8 v34.01,22.48
  Bottom 0.152: v14.94,5.33 13.41,5.33 R29.1 | v21.64,11.43 23.39,11.43 26.06,14.1 v26.06,16.46 | v34.01,22.48 35.87,22.48 36.58,21.77 36.58,20.57 U6.10
N$1
  Bottom 0.152: R25.2 39.15,3.39 39.99,4.23 IC1.11
N$2
  Bottom 0.152: IC1.9 41,5.18 41,3.66 40.84,3.5 R24.1
N$3  (via drill 0.35)
  Top 0.152: v10.52,6.25 9.45,5.18 LED1.2
  Bottom 0.152: v10.52,6.25 11.43,5.33 R29.2
N$4
  Top 0.508: F4.1 31.43,59.86 32.14,59.15 F1.1
N$5
  Bottom 0.152: R33.1 35.38,14.56 35.08,14.86 35.08,16.64 36.27,17.83 40.08,17.83 40.69,17.22 44.73,17.22 45.24,16.71 45.24,14.38 45.02,14.16 T2.1
N$6
  Bottom 0.152: D2.A 7.32,30.48 7.32,28.65 8.23,27.74 U4.P$4
N$7
  Bottom 0.152: R31.1 42.06,14.48 40.39,14.48 T1.1
N$8  (via drill 0.35)
  Top 0.152: v40.89,11.23 41.48,10.64 45.92,10.64 47.17,11.89 v49.99,11.89
  Bottom 0.152: v40.89,11.23 40.54,10.87 40.54,10.06 IC1.26 | v49.99,11.89 50.95,11.89 51.93,12.87 52.43,12.87 53.33,13.77 R26.2
N$9
  Bottom 0.508: F5.1 32.09,55.39 26.52,60.96 26.52,62.38 23.44,65.46 F2.1
N$10  (via drill 0.35)
  Top 0.152: v40.54,12.32 40.97,12.32 42.22,11.07 45.77,11.07 47.5,12.8 v49.99,12.8
  Bottom 0.152: v40.54,12.32 40.08,11.86 40.08,10.06 IC1.25 | v49.99,12.8 51.03,12.8 51.49,13.26 51.49,14.01 R27.2
N$11  (2 unrouted)
N$12  (1 unrouted)
  Bottom 0.152: 10.82,53.49 10.82,52.73 12.5,51.05 R8.2 | 12.65,53.49 13.26,52.88 13.26,50.29 13.11,50.14 12.65,50.14 11.73,49.23 11.73,47.85 12.5,47.09 12.5,46.02 R11.1
N$13  (2 unrouted)
N$14  (4 unrouted)
N$15  (2 unrouted)
N$16  (1 unrouted)
  Bottom 0.152: R12.1 10.82,40.21 R10.2 9.38,39.1 8.53,39.95 8.53,45.11 7.47,46.18 7.47,47.09
N$17
  Bottom 0.508: F3.1 32.3,45.34 32.09,45.13 F6.1
N$18  (3 unrouted)
N$19
  Bottom 0.152: R6.2 10.82,48.62 10.82,50.9 R8.1
N$20  (2 unrouted)
N$21  (via drill 0.35)
  Top 0.152: v10.52,2.59 9.45,3.66 LED1.1
  Bottom 0.152: v10.52,2.59 10.97,3.05 11.58,3.05 R30.2
N$22  (2 unrouted)
N$23
  Bottom 0.508: F1.2 22.88,55.5 18.57,59.82 15.38,59.82 12.56,62.63 CN1.1
N$24
  Top 0.508: CN1.2 12.34,66.83 14.39,64.77 18.66,64.77 22.24,61.19 F2.2
N$25
  Bottom 0.508: F3.2 30.23,47.89 30.23,55.75 28.07,57.91 22.12,57.91 17.51,62.52 CN1.3
N$26  (via drill 0.35)
  Top 0.152: v10.52,8.08 9.45,7.01 LED1.3
  Bottom 0.152: v10.52,8.08 11.12,7.47 11.43,7.47 R32.2
N$27  (1 unrouted)
  Bottom 0.152: 9.45,36.42 10.67,36.42 R7.2 | 7.62,36.42 7.62,38.71 R10.1
N$29
  Bottom 0.152: R5.2 12.51,36.61 R7.1
N$30  (2 unrouted)
N$31  (1 unrouted)
  Bottom 0.152: 10.22,43.39 R13.1 R11.2
N$32  (1 unrouted)
N$33  (2 unrouted)
N$34  (1 unrouted)
N$35  (2 unrouted)
N$36  (2 unrouted)
NEUTRAL  (via drill 0.35 pad 0.6)  (6 unrouted)
  Top 0.508: R40.2 48.45,59.5 45.21,62.74 41.66,62.74 40.58,63.82 R39.2 | U4.P$2 v24.06,46.44 26.81,43.69 29.21,43.69 30.23,44.7 36.32,44.7 39.12,41.91 43.98,41.91 R41.1 F6.2
  Bottom 0.152: 21.04,43.39 24.08,46.43 24.07,46.44 v24.06,46.44 | 12.5,43.28 12.5,41 R12.2
  Bottom 0.508: R41.1 R40.2
RTS
  Bottom 0.152: IC1.24 39.47,10.06 39.47,13.56 38.56,14.48 T1.2 38.41,14.63 36.88,16.15 36.27,16.15 R33.2
USB_CONNECTED
  Bottom 0.152: R3.1 44.5,1.83 42.82,3.5 R4.2 42.78,3.35 42.52,3.35 41.49,4.38 IC1.8
USB_D+
  Bottom 0.152: IC1.4 42.88,7.62 43.28,8.03 43.28,9.02 43.74,9.47 45.49,9.47 46.02,8.94 46.02,8.51 | 46.02,8.51 46.02,7.59 | X1.3 48.9,7.62 48.01,8.51 46.02,8.51
USB_D-  (via drill 0.35)  (1 unrouted)
  Top 0.152: v44.42,8.66 45.06,9.3 v46.89,9.3
  Bottom 0.152: 43.68,7.58 43.26,7.16 42.37,7.16 IC1.5 | 44.44,8.65 v44.42,8.66 | X1.2 50.38,8.29 48.83,8.29 47.83,9.3 v46.89,9.3
USB_RX
  Bottom 0.152: R27.1 51.36,15.85 51.36,16.92 48.92,19.36 48.92,21.54 44.35,26.11 44.35,37.49 U6.35
USB_TX  (via drill 0.35)
  Top 0.152: v52.63,18.01 49.12,18.01 46.91,20.22 46.91,29.54 42.98,33.48 v42.98,35.26
  Bottom 0.152: R26.1 53.33,17.31 v52.63,18.01 | v42.98,35.26 U6.34
VUSB  (via drill 0.35)
  Top 0.152: v47.85,5.21 v47.85,10.26
  Bottom 0.152: 47.85,6.27 v47.85,5.21 47.85,2.44 47.22,1.8 R3.2 | X1.1 48.99,8.92 47.85,10.06 v47.85,10.26 47.85,11.66 47.52,11.99 D1.A

### Text on the board
tPlace: PowerSpy